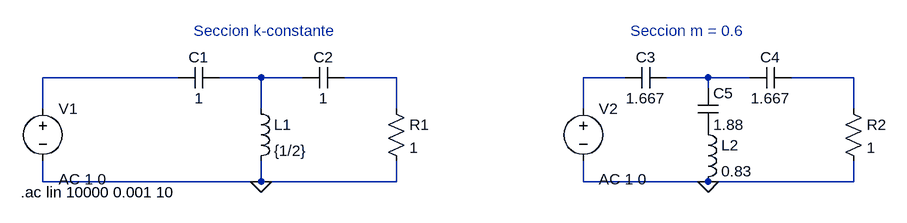
[diagram p0: schematic secciones.asc]
secciones.asc, the LTspice schematic file:
Version 4
SHEET 1 1128 680
WIRE 32 112 -176 112
WIRE 160 112 96 112
WIRE 224 112 160 112
WIRE 368 112 288 112
WIRE 720 112 656 112
WIRE 848 112 784 112
WIRE 912 112 848 112
WIRE 1072 112 976 112
WIRE 848 128 848 112
WIRE -176 160 -176 112
WIRE 160 160 160 112
WIRE 368 160 368 112
WIRE 656 160 656 112
WIRE 1072 160 1072 112
WIRE -176 272 -176 240
WIRE 160 272 160 240
WIRE 160 272 -176 272
WIRE 368 272 368 240
WIRE 368 272 160 272
WIRE 656 272 656 240
WIRE 848 272 656 272
WIRE 1072 272 1072 240
WIRE 1072 272 848 272
FLAG 160 272 0
FLAG 848 272 0
SYMBOL cap 96 96 R90
WINDOW 0 0 32 VBottom 2
WINDOW 3 32 32 VTop 2
SYMATTR InstName C1
SYMATTR Value 1
SYMBOL cap 288 96 R90
WINDOW 0 0 32 VBottom 2
WINDOW 3 32 32 VTop 2
SYMATTR InstName C2
SYMATTR Value 1
SYMBOL ind 144 144 R0
SYMATTR InstName L1
SYMATTR Value {1/2}
SYMBOL cap 784 96 R90
WINDOW 0 0 32 VBottom 2
WINDOW 3 32 32 VTop 2
SYMATTR InstName C3
SYMATTR Value 1.667
SYMBOL cap 976 96 R90
WINDOW 0 0 32 VBottom 2
WINDOW 3 32 32 VTop 2
SYMATTR InstName C4
SYMATTR Value 1.667
SYMBOL ind 832 176 R0
SYMATTR InstName L2
SYMATTR Value 0.83
SYMBOL cap 832 128 R0
SYMATTR InstName C5
SYMATTR Value 1.88
SYMBOL voltage -176 144 R0
WINDOW 123 24 124 Left 2
SYMATTR InstName V1
SYMATTR Value ""
SYMATTR Value2 AC 1 0
SYMBOL voltage 656 144 R0
WINDOW 123 24 124 Left 2
WINDOW 39 0 0 Left 0
SYMATTR InstName V2
SYMATTR Value ""
SYMATTR Value2 AC 1 0
SYMBOL res 352 144 R0
SYMATTR InstName R1
SYMATTR Value 1
SYMBOL res 1056 144 R0
SYMATTR InstName R2
SYMATTR Value 1
TEXT 56 40 Left 2 ;Seccion k-constante
TEXT 728 40 Left 2 ;Seccion m = 0.6
TEXT -210 288 Left 2 !.ac lin 10000 0.001 10

The netlist it stands for:
* secciones.asc
C1 N002 N001 1
C2 N003 N002 1
L1 N002 0 {1/2}
C3 N005 N004 1.667
C4 N006 N005 1.667
L2 P001 0 0.83
C5 N005 P001 1.88
V1 N001 0 AC 1 0
V2 N004 0 AC 1 0
R1 N003 0 1
R2 N006 0 1
* Seccion k-constante
* Seccion m = 0.6
.ac lin 10000 0.001 10
.backanno
.end